# Altium project RTU_LMG.PrjPcb (part 3 of 3)

## Sheet RTU_LMG_DO.SchDoc
size A4; SheetNumber: 16; SheetTotal: 17
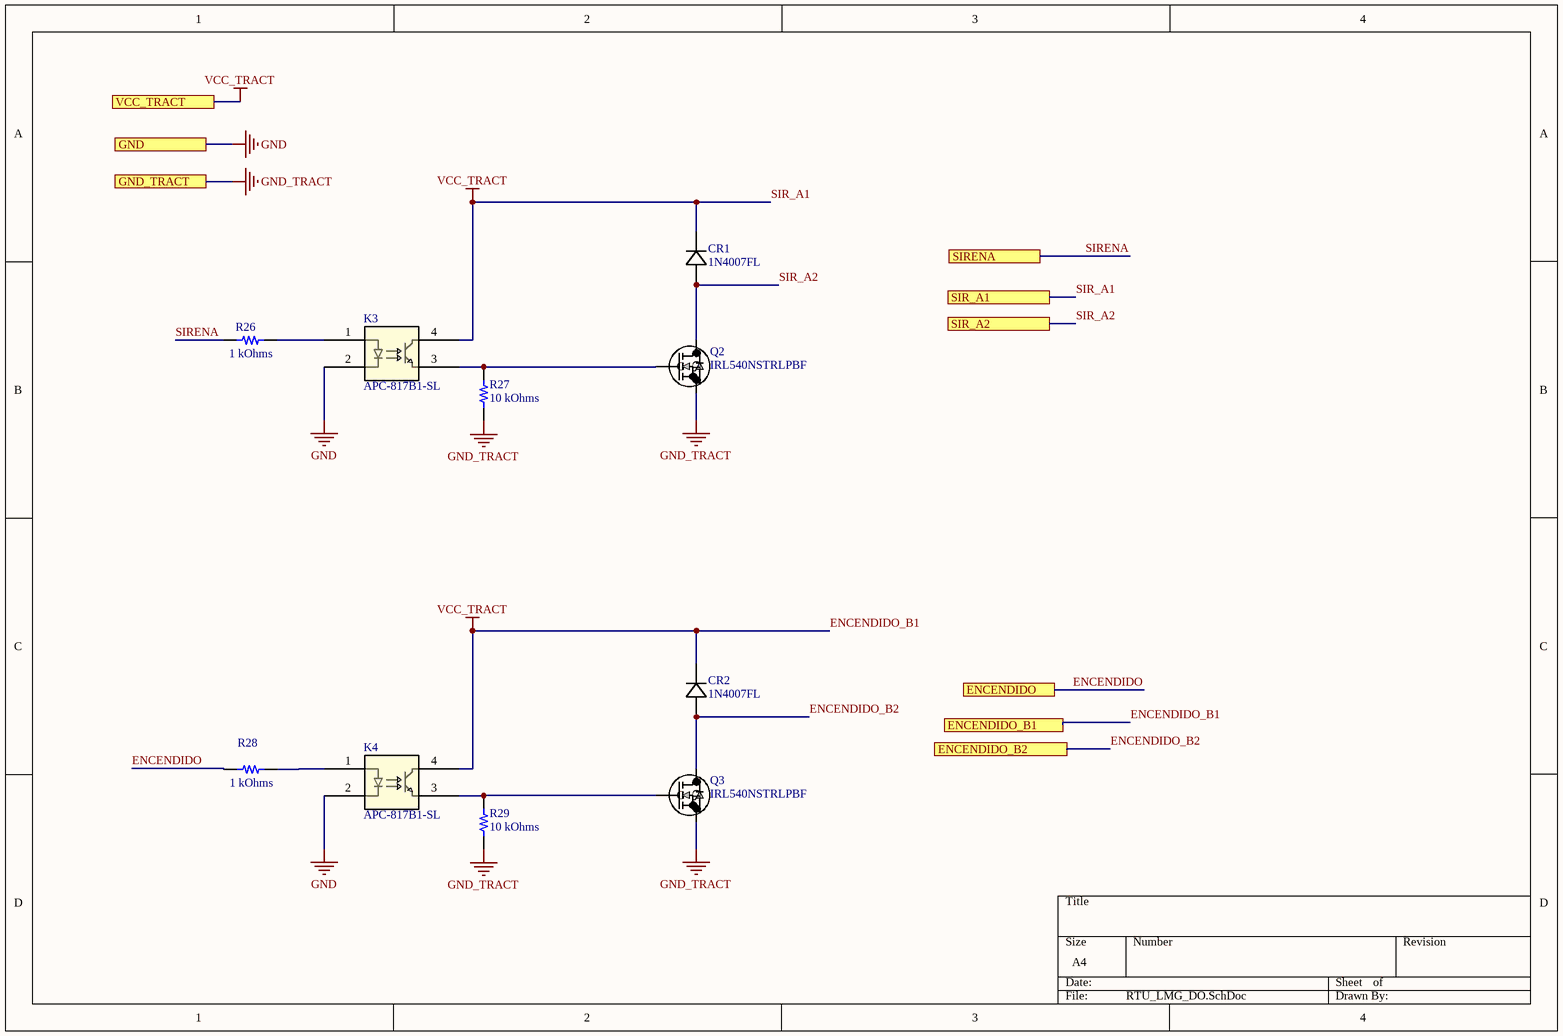
[diagram p14: RTU_LMG_DO.SchDoc]

### Parts
CR1  1N4007FL  [CR_SOD-123FL_SME]
CR2  1N4007FL  [CR_SOD-123FL_SME]
K3  APC-817B1-SL  [APC-817xx-SL_AMB]
K4  APC-817B1-SL  [APC-817xx-SL_AMB]
Q2  IRL540NSTRLPBF  [NMOSGSD_D2PAK_IRL540NSTRLPBF_INF]
Q3  IRL540NSTRLPBF  [NMOSGSD_D2PAK_IRL540NSTRLPBF_INF]
R26  1 kOhms  [RES 0402_1005]
R27  10 kOhms  [RES 0603_1608]
R28  1 kOhms  [RES 0402_1005]
R29  10 kOhms  [RES 0603_1608]

### Ports
ENCENDIDO, ENCENDIDO_B1, ENCENDIDO_B2, GND, GND_TRACT, SIR_A1, SIR_A2, SIRENA, VCC_TRACT

### Nets
GND: K3.2 K4.2 ; port GND
GND_TRACT: Q2.2(S) Q3.2(S) R27.1 R29.1 ; port GND_TRACT
VCC_TRACT: CR1.1(CATHODE) CR2.1(CATHODE) K3.4 K4.4 ; port VCC_TRACT, port SIR_A1, port ENCENDIDO_B1  [also labelled ENCENDIDO_B1, SIR_A1]
ENCENDIDO: R28.1 ; port ENCENDIDO
ENCENDIDO_B2: CR2.2(ANODE) Q3.3(D) ; port ENCENDIDO_B2
SIR_A2: CR1.2(ANODE) Q2.3(D) ; port SIR_A2
SIRENA: R26.1 ; port SIRENA
NetK3_1: K3.1 R26.2
NetK3_3: K3.3 Q2.1(G) R27.2
NetK4_1: K4.1 R28.2
NetK4_3: K4.3 Q3.1(G) R29.2

### Library data of the parts
CR1 CR2 = 1N4007FL: Description; Manufacturer_Name: SMC Diode Solutions; Copyright: Copyright (C) 2025 Ultra Librarian. All rights reserved.; Manufacturer_Part_Number: 1N4007FL
K3 K4 = APC-817B1-SL: Description; Manufacturer_Name: American Bright; Type: Optoisolators; Copyright: Copyright (C) 2025 Ultra Librarian. All rights reserved.; Manufacturer_Part_Number: APC-817B1-SL; RefDes: RefDes
Q2 Q3 = IRL540NSTRLPBF: Description; Manufacturer_Name: Infineon; Copyright: Copyright (C) 2025 Ultra Librarian. All rights reserved.; Manufacturer_Part_Number: IRL540NSTRLPBF
R26 R28 = AT0402BRD071KL: RES SMD 1K OHM 0.1% 1/16W 0402; Manufacturer: Yageo; Power (Watts): 0.063W, 1/16W; Temperature Coefficient: ±25ppm/°C; Part Number: AT0402BRD071KL; Value: 1 kOhms; ComponentLink1Description: Datasheet; ComponentLink1URL: http://www.yageo.com/documents/recent/PYu-AT_51_RoHS_L_5.pdf; ComponentLink2Description: DigiKey Link; ComponentLink2URL: https://www.digikey.com/en/products/detail/yageo/AT0402BRD071KL/5138607; Composition: Thin Film; Device Package: 0402 (1005 Metric); Features: Anti-Sulfur, Automotive AEC-Q200, Moisture Resistant; Height - Seated (Max): 0.014" (0.35mm); LastUpdated: 31/8/2025 15:04:18; Lifecycle Status: Active; Minimum Order: 1; Number of Terminations: 2; Operating Temperature: -55°C ~ 155°C; Package / Case: 0402 (1005 Metric); Packaging: TapeAndReel; PartId: 2462; Part Status: Active; Price: 0.09; Ratings: AEC-Q200; Resistance: 1 kOhms; Series: AT; Size / Dimension: 0.039" L x 0.020" W (1.00mm x 0.50mm); Supplier 1: DigiKey; Supplier Part Number 1: YAG2088CT-ND; Supplier Device Package: 0402; Tolerance: ±0.1%
R27 R29 = RC0603FR-0710KL: RES 10K OHM 1% 1/10W 0603; Manufacturer: Yageo; Power (Watts): 0.1W, 1/10W; Temperature Coefficient: ±100ppm/°C; Part Number: RC0603FR-0710KL; Value: 10 kOhms; ComponentLink1Description: Datasheet; ComponentLink1URL: https://www.yageo.com/upload/media/product/productsearch/datasheet/rchip/PYu-RC_Group_51_RoHS_L_10.pdf; ComponentLink2Description: DigiKey Link; ComponentLink2URL: https://www.digikey.com/en/products/detail/yageo/RC0603FR-0710KL/726880; Composition: Thick Film; Device Package: 0603 (1608 Metric); Features: Moisture Resistant; Height - Seated (Max): 0.022" (0.55mm); LastUpdated: 10/30/2023 7:36:43 PM; Lifecycle Status: Active; Minimum Order: 1; Number of Terminations: 2; Operating Temperature: -55°C ~ 155°C; Package / Case: 0603 (1608 Metric); Packaging: CutTape; PartId: 22599; Part Status: Active; Price: 0.01; Resistance: 10 kOhms; Series: RC_L; Size / Dimension: 0.063" L x 0.031" W (1.60mm x 0.80mm); Supplier 1: DigiKey; Supplier Part Number 1: 311-10.0KHRCT-ND; Supplier Device Package: 0603; Tolerance: ±1%

## Sheet RTU_LMG_CAN.SchDoc
size A3; SheetNumber: 14; SheetTotal: 17
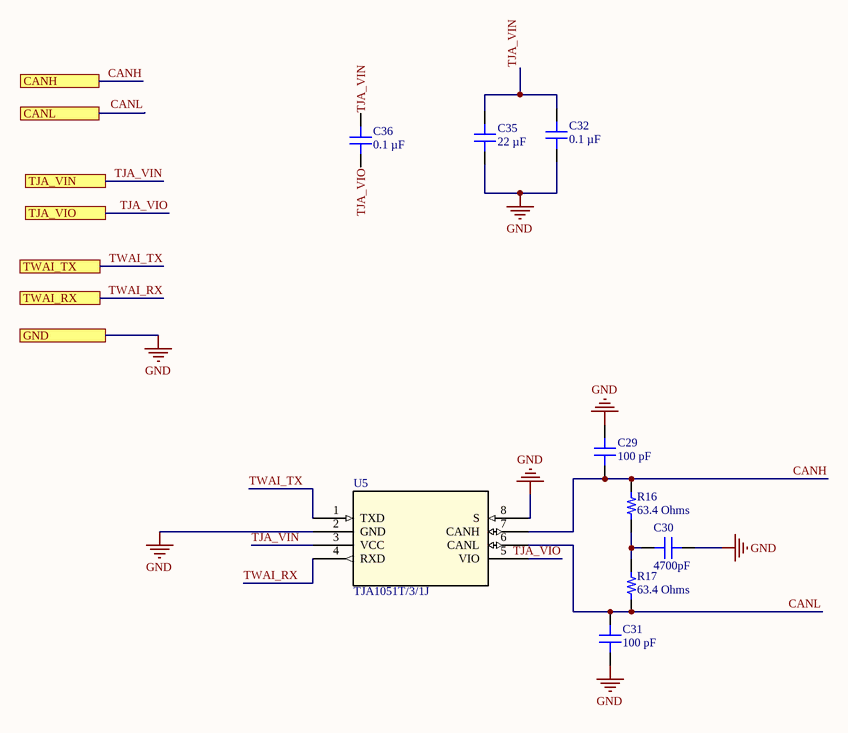
[diagram p15: RTU_LMG_CAN.SchDoc]

### Parts
C29  100 pF  [CAP 0402_1005]
C30  4700pF  [CAP 0402_1005]
C31  100 pF  [CAP 0402_1005]
C32  0.1 µF  [CAP 0402_1005]
C35  22 µF  [CAP 0805_2012]
C36  0.1 µF  [CAP 0402_1005]
R16  63.4 Ohms  [RES 0805_2012]
R17  63.4 Ohms  [RES 0805_2012]
U5  TJA1051T/3/1J  [SO8_SOT96-1_NXP]

### Ports
CANH, CANL, GND, TJA_VIN, TJA_VIO, TWAI_RX, TWAI_TX

### Nets
GND: C29.2 C30.2 C31.1 C32.2 C35.1 U5.2(GND) U5.8(S) ; port GND
TJA_VIN: C32.1 C35.2 C36.1 U5.3(VCC) ; port TJA_VIN  [project net 5V]
TJA_VIO: C36.2 U5.5(VIO) ; port TJA_VIO  [project net 3V3]
CANH: C29.1 R16.2 U5.7(CANH) ; port CANH
CANL: C31.2 R17.1 U5.6(CANL) ; port CANL
TWAI_RX: U5.4(RXD) ; port TWAI_RX  [project net TWAI_RD]
TWAI_TX: U5.1(TXD) ; port TWAI_TX  [project net TWAI_TD]
NetC30_1: C30.1 R16.1 R17.2

### Library data of the parts
C29 C31 = 500X07N101MV4T: CAP CER 100PF 50V C0G/NP0 0402; manufacturer: Johanson Dielectrics Inc.; Temperature Coefficient: C0G, NP0; Tolerance: ±20%; Part Number: 500X07N101MV4T; Capacitance: 100 pF; Applications: Bypass, Decoupling; componentlink1description: Datasheet; componentlink1url: https://www.johansondielectrics.com/downloads/x2y-filter-and-decoupling-capacitors.pdf; componentlink2description: DigiKey Link; componentlink2url: https://www.digikey.com/en/products/detail/johanson-dielectrics-inc/500X07N101MV4T/2046917; Device Package: 0402 (1005 Metric); Features: Low ESL (X2Y); lastupdated: 9/2/2024 20:04:38; Lifecycle Status: Active; Minimum Order: 1; Mounting Type: Surface Mount, MLCC; Operating Temperature: -55°C ~ 125°C; Package / Case: 0402 (1005 Metric); packaging: TapeAndReel; partid: 1767; Part Status: Active; price: 0.08; series: X2Y®; Size / Dimension: 0.045" L x 0.025" W (1.14mm x 0.64mm); Supplier 1: DigiKey; Supplier Part Number 1: 709-1214-1-ND; Thickness (Max): 0.020" (0.51mm); value: 100 pF; Voltage - Rated: 50V
C30 = 04025C472KAT2A: CAP CER 4700PF 50V X7R 0402; manufacturer: AVX Corporation; Tolerance: ±10%; Part Number: 04025C472KAT2A; Capacitance: 4700pF; Applications: General Purpose; componentlink1description: Datasheet; componentlink1url: http://datasheets.avx.com/X7RDielectric.pdf; componentlink2description: DigiKey Link; componentlink2url: http://digikey.com/product-detail/en/avx-corporation/04025C472KAT2A/478-1109-1-ND/564141; Device Package: 0402 (1005 Metric); lastupdated: 8/2/2022 12:26:58; Lifecycle Status: Active; Minimum Order: 1; Mounting Type: Surface Mount, MLCC; Operating Temperature: -55°C ~ 125°C; Package / Case: 0402 (1005 Metric); packaging: TapeAndReel; partid: 1774; Part Status: Active; price: 0.02; series: -; Size / Dimension: 0.039" L x 0.020" W (1.00mm x 0.50mm); Supplier 1: DigiKey; Supplier Part Number 1: 478-1109-1-ND; Temperature Coefficient: X7R; Thickness (Max): 0.022" (0.56mm); value: 4700pF; Voltage - Rated: 50V
C32 C36 = CGA2B3X5R1H104M050BB: CAP CER 0.1UF 50V X5R 0402; manufacturer: TDK Corporation; Tolerance: ±20%; Part Number: CGA2B3X5R1H104M050BB; Capacitance: 0.1 µF; Applications: Automotive; componentlink1description: Datasheet; componentlink1url: https://product.tdk.com/info/en/catalog/datasheets/mlcc_automotive_general_en.pdf?ref_disty=digikey; componentlink2description: DigiKey Link; componentlink2url: https://www.digikey.com/en/products/detail/tdk-corporation/CGA2B3X5R1H104M050BB/3949450; Device Package: 0402 (1005 Metric); lastupdated: 9/2/2024 20:04:38; Lifecycle Status: Active; Minimum Order: 1; Mounting Type: Surface Mount, MLCC; Operating Temperature: -55°C ~ 85°C; Package / Case: 0402 (1005 Metric); packaging: TapeAndReel; partid: 1792; Part Status: Active; price: 0.01; Ratings: AEC-Q200; series: CGA; Size / Dimension: 0.039" L x 0.020" W (1.00mm x 0.50mm); Supplier 1: DigiKey; Supplier Part Number 1: 445-12214-1-ND; Temperature Coefficient: X5R; Thickness (Max): 0.022" (0.55mm); value: 0.1 µF; Voltage - Rated: 50V
C35 = CL21A226MOCLRNC: CAP CER 22UF 16V X5R 0805; manufacturer: Samsung Electro-Mechanics; Tolerance: ±20%; Part Number: CL21A226MOCLRNC; Value: 22 µF; Applications: General Purpose; Capacitance: 22 µF; componentlink1description: Datasheet; componentlink1url: http://www.samsungsem.com/kr/support/product-search/mlcc/CL21A226MOCLRNC.jsp; componentlink2description: DigiKey Link; componentlink2url: https://www.digikey.com/en/products/detail/samsung-electro-mechanics/CL21A226MOCLRNC/5961264; Device Package: 0805 (2012 Metric); Features: Low Profile; lastupdated: 10/30/2023 7:14:19 PM; Lifecycle Status: Active; Minimum Order: 1; Mounting Type: Surface Mount, MLCC; Operating Temperature: -55°C ~ 85°C; Package / Case: 0805 (2012 Metric); packaging: TapeAndReel; partid: 4767; Part Status: Active; price: 0.05; series: CL; Size / Dimension: 0.079" L x 0.049" W (2.00mm x 1.25mm); Supplier 1: DigiKey; Supplier Part Number 1: 1276-6780-1-ND; Temperature Coefficient: X5R; Thickness (Max): 0.037" (0.95mm); Voltage - Rated: 16V
R16 R17 = ERJ-6ENF63R4V: RES SMD 63.4 OHM 1% 1/8W 0805; Manufacturer: Panasonic Electronic Components; Power (Watts): 0.125W, 1/8W; Temperature Coefficient: ±100ppm/°C; Part Number: ERJ-6ENF63R4V; Value: 63.4 Ohms; ComponentLink1Description: Datasheet; ComponentLink1URL: https://industrial.panasonic.com/cdbs/www-data/pdf/RDA0000/AOA0000C304.pdf; ComponentLink2Description: DigiKey Link; ComponentLink2URL: https://www.digikey.com/en/products/detail/panasonic-electronic-components/ERJ-6ENF63R4V/111047; Composition: Thick Film; Device Package: 0805 (2012 Metric); Features: Automotive AEC-Q200; Height - Seated (Max): 0.028" (0.70mm); LastUpdated: 8/2/2024 21:02:31; Lifecycle Status: Active; Minimum Order: 1; Number of Terminations: 2; Operating Temperature: -55°C ~ 155°C; Package / Case: 0805 (2012 Metric); Packaging: TapeAndReel; PartId: 29434; Part Status: Active; Price: 0.01; Ratings: AEC-Q200; Resistance: 63.4 Ohms; Series: ERJ-6EN; Size / Dimension: 0.079" L x 0.049" W (2.00mm x 1.25mm); Supplier 1: DigiKey; Supplier Part Number 1: P63.4CCT-ND; Supplier Device Package: 0805; Tolerance: ±1%
U5 = TJA1051T31J: Description; Manufacturer_Name: NXP; Copyright: Copyright (C) 2025 Ultra Librarian. All rights reserved.; Manufacturer_Part_Number: TJA1051T/3/1J; RefDes: RefDes; Type: Type

## Nets that join several sheets
3V3: RTU_LMG_Microcontroller (7 pins), RTU_LMG_IO_Expanders (C13.2 C14.2 U3.16), RTU_LMG_Modem (C28.2 IC4.8 R13.2), RTU_LMG_gps_acond (C44.2 U6.4 U6.5), RTU_LMG_Linear_Voltage_Regulator_3V3 (C7.2 TP_3V3.1 U1.2), RTU_LMG_ORing3V3 (10 pins), RTU_LMG_RTC (5 pins), RTU_LMG_LoRa_Module (C39.1 C42.2 IC2.24 R18.1), RTU_LMG_DI (R15.2 R23.2), RTU_LMG_CAN (C36.2 U5.5)
3V8: RTU_LMG_Modem (14 pins), RTU_LMG_Linear_Voltage_Regulator_3V8 (C9.2 IC3.2 R3.2 TP_3V8.1)
5V: RTU_LMG_Linear_Voltage_Regulator_3V3 (C6.1 U1.3), RTU_LMG_Linear_Voltage_Regulator_3V8 (C8.1 IC3.3), RTU_LMG_Battery_Charger (C49.1 IC1.1 LED1.A TP_VBTY_CH1.1), RTU_LMG_CAN (C32.1 C35.2 C36.1 U5.3)
GND: RTU_LMG_Block_Diagram (10 pins), RTU_LMG_Microcontroller (23 pins), RTU_LMG_IO_Expanders (6 pins), RTU_LMG_Modem (51 pins), RTU_LMG_gps_acond (6 pins), RTU_LMG_Linear_Voltage_Regulator_3V3 (C6.2 C7.1 U1.1), RTU_LMG_Linear_Voltage_Regulator_3V8 (C8.2 C9.1 R4.1), RTU_LMG_ORing3V3 (R6.1 R12.1), RTU_LMG_RTC (C1.2 C2.2 C3.2 IC8.7), RTU_LMG_LoRa_Module (10 pins), RTU_LMG_Battery_Charger (8 pins), RTU_LMG_LM2596 (13 pins), RTU_LMG_DI (K1.2 K1.3 K2.2 K2.3), RTU_LMG_DO (K3.2 K4.2), RTU_LMG_CAN (7 pins)
VCC_TRACT: RTU_LMG_Block_Diagram (B1.1 B1.2 B1.3 D1.2), RTU_LMG_LM2596 (C33.2 C37.1 C57.2 U7.1), RTU_LMG_DO (CR1.1 CR2.1 K3.4 K4.4)
VIN_BTY_CH: RTU_LMG_Battery_Charger (C50.2 IC1.10), RTU_LMG_LM2596 (B2.1 B2.2 B2.3 R2.2)
~{CE}: RTU_LMG_Microcontroller (U2.24), RTU_LMG_Battery_Charger (IC1.4)
~{INT}: RTU_LMG_Microcontroller (U2.26), RTU_LMG_Battery_Charger (IC1.9)
AIN0: RTU_LMG_Block_Diagram (J5.2), RTU_LMG_Microcontroller (U2.5)
BAT_IN: RTU_LMG_Block_Diagram (J4.02), RTU_LMG_Battery_Charger (IC1.2 R33.1)
CANH: RTU_LMG_Block_Diagram (J7.1), RTU_LMG_CAN (C29.1 R16.2 U5.7)
CANL: RTU_LMG_Block_Diagram (J7.2), RTU_LMG_CAN (C31.2 R17.1 U5.6)
EN: RTU_LMG_Block_Diagram (J13.1), RTU_LMG_Microcontroller (C15.2 R10.1 U2.3)
ENCENDIDO: RTU_LMG_IO_Expanders (U3.6), RTU_LMG_DO (R28.1)
ENCENDIDO_B2: RTU_LMG_Block_Diagram (J8.2), RTU_LMG_DO (CR2.2 Q3.3)
GPIO0: RTU_LMG_Block_Diagram (J13.6), RTU_LMG_Microcontroller (U2.25)
GREEN_LED: RTU_LMG_Microcontroller (C41.2 R9.1), RTU_LMG_IO_Expanders (U3.4)
IN_ON/OFF: RTU_LMG_Block_Diagram (J6.1), RTU_LMG_DI (R25.1)
IN_SPUERTAS: RTU_LMG_Block_Diagram (J6.2), RTU_LMG_DI (R24.1)
LORA_RST: RTU_LMG_Microcontroller (U2.4), RTU_LMG_LoRa_Module (IC5.1 R19.1)
LORA_RX_1: RTU_LMG_Microcontroller (U2.11 U2.36), RTU_LMG_LoRa_Module (S2.2A)
LORA_TX_1: RTU_LMG_Microcontroller (U2.12), RTU_LMG_LoRa_Module (S2.1A)
MBAT: RTU_LMG_Microcontroller (U2.7), RTU_LMG_Battery_Charger (C53.2 R33.2 R34.1)
MODEM_DTR: RTU_LMG_IO_Expanders (U3.12), RTU_LMG_Modem (R20.2)
MODEM_PWRKEY: RTU_LMG_IO_Expanders (U3.11), RTU_LMG_Modem (Q1.2 R14.1)
MODEM_RX: RTU_LMG_Microcontroller (U2.31), RTU_LMG_Modem (IC4.6 TP_MRX.1)
MODEM_STATUS: RTU_LMG_IO_Expanders (U3.10), RTU_LMG_Modem (Q1.3 R13.1 TP_STATUS.1)
MODEM_TX: RTU_LMG_Microcontroller (U2.33), RTU_LMG_Modem (IC4.7 TP_MTX.1)
PUERTA_ABIERTA: RTU_LMG_IO_Expanders (U3.7), RTU_LMG_DI (K1.4 R15.1)
RFIN: RTU_LMG_Modem (J12.1), RTU_LMG_gps_acond (U8.1)
RFOUT: RTU_LMG_Modem (C18.2), RTU_LMG_gps_acond (U6.6)
SCL: RTU_LMG_Microcontroller (R8.1 TP_SCL.1 U2.9), RTU_LMG_IO_Expanders (U3.14), RTU_LMG_RTC (IC8.2), RTU_LMG_Battery_Charger (IC1.8)
SDA: RTU_LMG_Microcontroller (R7.1 TP_SDA.1 U2.8), RTU_LMG_IO_Expanders (U3.15), RTU_LMG_RTC (IC8.3), RTU_LMG_Battery_Charger (IC1.7)
SIR_A2: RTU_LMG_Block_Diagram (J8.1), RTU_LMG_DO (CR1.2 Q2.3)
SIRENA: RTU_LMG_IO_Expanders (U3.5), RTU_LMG_DO (R26.1)
TCK: RTU_LMG_Block_Diagram (J2.4), RTU_LMG_Microcontroller (U2.16)
TDI: RTU_LMG_Block_Diagram (J2.8), RTU_LMG_Microcontroller (U2.14)
TDO: RTU_LMG_Block_Diagram (J2.6), RTU_LMG_Microcontroller (U2.23)
TMS: RTU_LMG_Block_Diagram (J2.2), RTU_LMG_Microcontroller (U2.13)
TRACTOR_ON: RTU_LMG_IO_Expanders (U3.9), RTU_LMG_DI (K2.4 R23.1)
TWAI_RD: RTU_LMG_Microcontroller (U2.37), RTU_LMG_CAN (U5.4)
TWAI_TD: RTU_LMG_Microcontroller (U2.10), RTU_LMG_CAN (U5.1)
UART0_RX: RTU_LMG_Block_Diagram (J13.5), RTU_LMG_Microcontroller (U2.34)
UART0_TX: RTU_LMG_Block_Diagram (J13.3), RTU_LMG_Microcontroller (U2.35)
VCCPROG: RTU_LMG_Block_Diagram (J13.2), RTU_LMG_ORing3V3 (B4.5 B4.6 B4.7 B4.8)
VOUT_OK: RTU_LMG_Microcontroller (U2.6), RTU_LMG_LM2596 (C34.2 R2.1 R11.2)